# Altium schematic sheet CoreProcessor.SchDoc
size A4
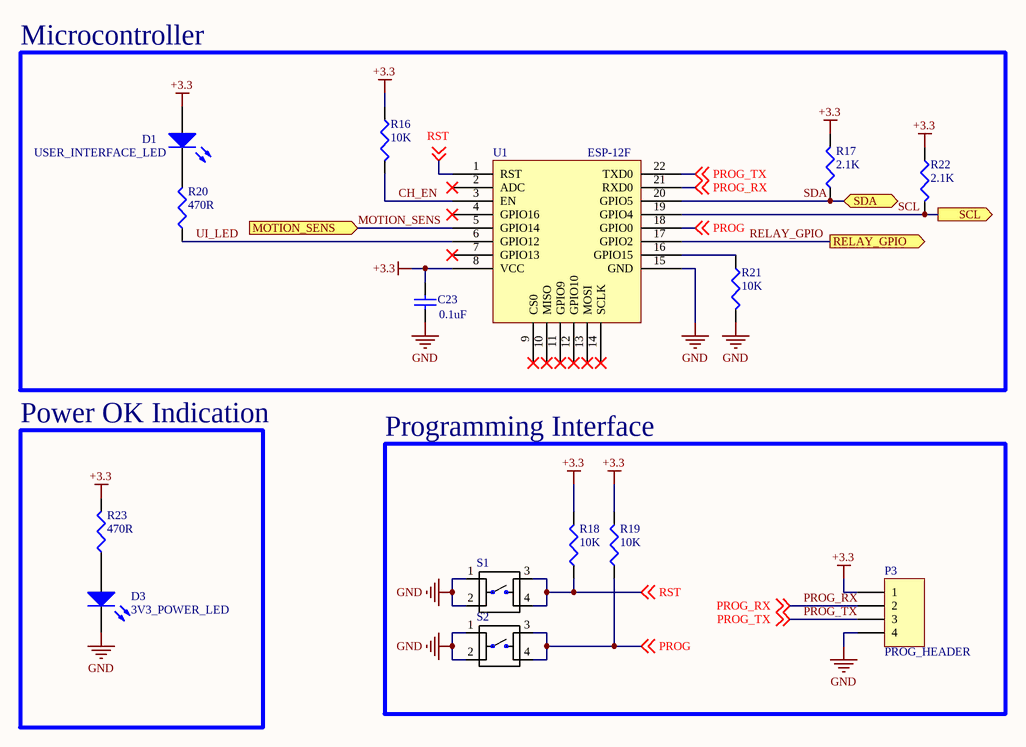
[diagram p0: CoreProcessor.SchDoc]

## Parts
C23  value 0.1uF  [C0603]  (hidden comment: MUDAR FOOTPRINT)
D1  USER_INTERFACE_LED  [LED0603]
D3  3V3_POWER_LED  [LED0603]
P3  PROG_HEADER  [HDR1X4]
R16  value 10K  [R0603]  (hidden comment: Res3)
R17  value 2.1K  [R0603]  (hidden comment: Res3)
R18  value 10K  [R0603]  (hidden comment: Res3)
R19  value 10K  [R0603]  (hidden comment: Res3)
R20  value 470R  [R0603]  (hidden comment: Res3)
R21  value 10K  [R0603]  (hidden comment: Res3)
R22  value 2.1K  [R0603]  (hidden comment: Res3)
R23  value 470R  [R0603]  (hidden comment: Res3)
S1  FSM8JH  [SW_FSM8JH]  (value not drawn)
S2  FSM8JH  [SW_FSM8JH]  (value not drawn)
U1  ESP-12F  [XCVR_ESP8266-12E/ESP-12E]

## Blocks framed on the sheet
Microcontroller: C23 D1 R16 R17 R20-R22 U1
Power OK Indication: D3 R23
Programming Interface: P3 R18 R19 S1 S2

## Ports
MOTION_SENS (in), RELAY_GPIO (out), SCL (out), SDA (bidir)

## Nets
+3.3: C23.2 D1.2(A) P3.1 R16.1 R17.2 R18.2 R19.2 R22.2 R23.2 U1.8(VCC)
GND: C23.1 D3.1(K) P3.4 R21.2 S1.1 S1.2 S2.1 S2.2 U1.15(GND)
CH_EN: R16.2 U1.3(EN)
MOTION_SENS: U1.5(GPIO14) ; port MOTION_SENS
PROG: R19.1 S2.3 S2.4 U1.18(GPIO0) ; off-sheet PROG
PROG_RX: P3.2 U1.21(RXD0) ; off-sheet PROG_RX
PROG_TX: P3.3 U1.22(TXD0) ; off-sheet PROG_TX
RELAY_GPIO: U1.17(GPIO2) ; port RELAY_GPIO
RST: R18.1 S1.3 S1.4 U1.1(RST) ; off-sheet RST
SCL: R22.1 U1.19(GPIO4) ; port SCL
SDA: R17.1 U1.20(GPIO5) ; port SDA
UI_LED: R20.1 U1.6(GPIO12)
NetD1_1: D1.1(K) R20.2
NetD3_2: D3.2(A) R23.1
NetR21_1: R21.1 U1.16(GPIO15)

Not connected (* = marked no-connect by the designer): U1 2(ADC)* 4(GPIO16)* 7(GPIO13)* 9(CS0)* 10(MISO)* 11(GPIO9)* 12(GPIO10)* 13(MOSI)* 14(SCLK)*

## Notes on the sheet
- Title
- Size:
- Date:
- A4
- Number:
- Time:
- Revision:
- Sheet
- of
- File:

## Library data of the parts
C23 = Cap Semi: Capacitor (Semiconductor SIM Model); Published: 8-Jun-2000; LatestRevisionDate: 29-May-2009; LatestRevisionNote: IPC-7351 Footprint Added.; PackageReference: C1206; Publisher: Altium Limited; PackageDescription: Chip Capacitor
D1 D3 = LED0: Typical INFRARED GaAs LED; Published: 8-Jun-2000; LatestRevisionDate: 08-Jul-2005; LatestRevisionNote: Mech Layer 1 removed.; PackageReference: LED-0; Publisher: Altium Limited; PackageDescription: LED; 2 Leads
P3 = Header 4: Header, 4-Pin; LatestRevisionDate: 17-Jul-2002; LatestRevisionNote: Re-released for DXP Platform.; Publisher: Altium Limited
R16-R23 = Res3: Resistor; Published: 8-Jun-2000; LatestRevisionDate: 29-May-2009; LatestRevisionNote: IPC-7351 Footprint Added.; PackageReference: J1-0603; Publisher: Altium Limited; PackageDescription: Chip Resistor
S1 S2 = BUTTON: Switch, Pushbutton, Tactile, SPST, Thru Hole, Vertical, 6MM, Black; MF: TE Connectivity / Alcoswitch; Availability: Good; Price: 0.07 USD; Package: None; MP: FSM8JH; SnapEDA_Link: https://www.snapeda.com/parts/FSM8JH/TE%2520Connectivity%2520/%2520Alcoswitch/view-part/?ref=snap; Value: *